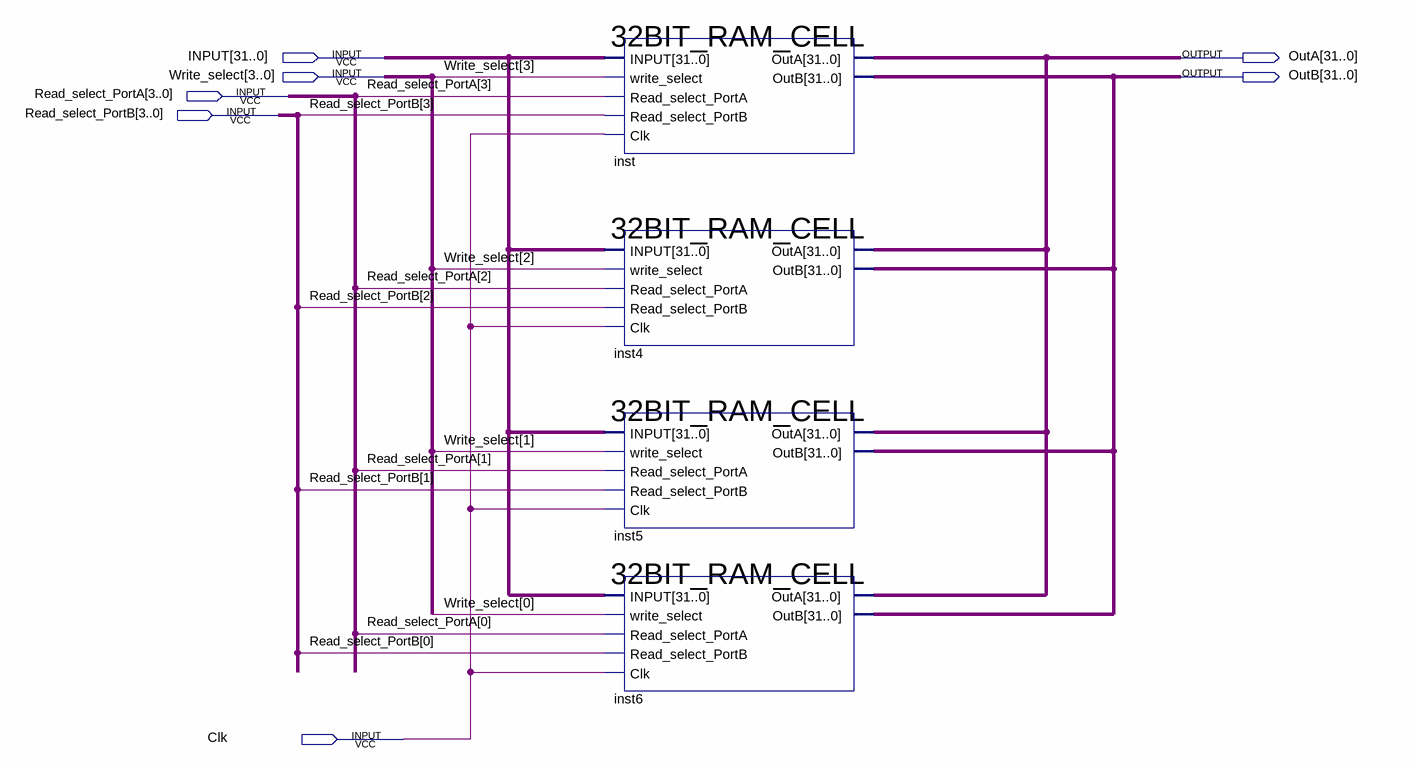
[diagram p0: schematic sheet]
// Quartus schematic 32BITx4.bdf as structural Verilog: 4 symbols, 7 pins
module \32BITx4  (
  input  [31:0] INPUT,
  input  [3:0] Write_select,
  input  [3:0] Read_select_PortA,
  input  [3:0] Read_select_PortB,
  input  Clk,
  output [31:0] OutA,
  output [31:0] OutB
);

  \32BIT_RAM_CELL  inst (
    .INPUT(INPUT), .write_select(Write_select[3]), .Read_select_PortA(Read_select_PortA[3]),
    .Read_select_PortB(Read_select_PortB[3]), .Clk(Clk), .OutA(OutA), .OutB(OutB));
  \32BIT_RAM_CELL  inst4 (
    .INPUT(INPUT), .write_select(Write_select[2]), .Read_select_PortA(Read_select_PortA[2]),
    .Read_select_PortB(Read_select_PortB[2]), .Clk(Clk), .OutA(OutA), .OutB(OutB));
  \32BIT_RAM_CELL  inst5 (
    .INPUT(INPUT), .write_select(Write_select[1]), .Read_select_PortA(Read_select_PortA[1]),
    .Read_select_PortB(Read_select_PortB[1]), .Clk(Clk), .OutA(OutA), .OutB(OutB));
  \32BIT_RAM_CELL  inst6 (
    .INPUT(INPUT), .write_select(Write_select[0]), .Read_select_PortA(Read_select_PortA[0]),
    .Read_select_PortB(Read_select_PortB[0]), .Clk(Clk), .OutA(OutA), .OutB(OutB));
endmodule
